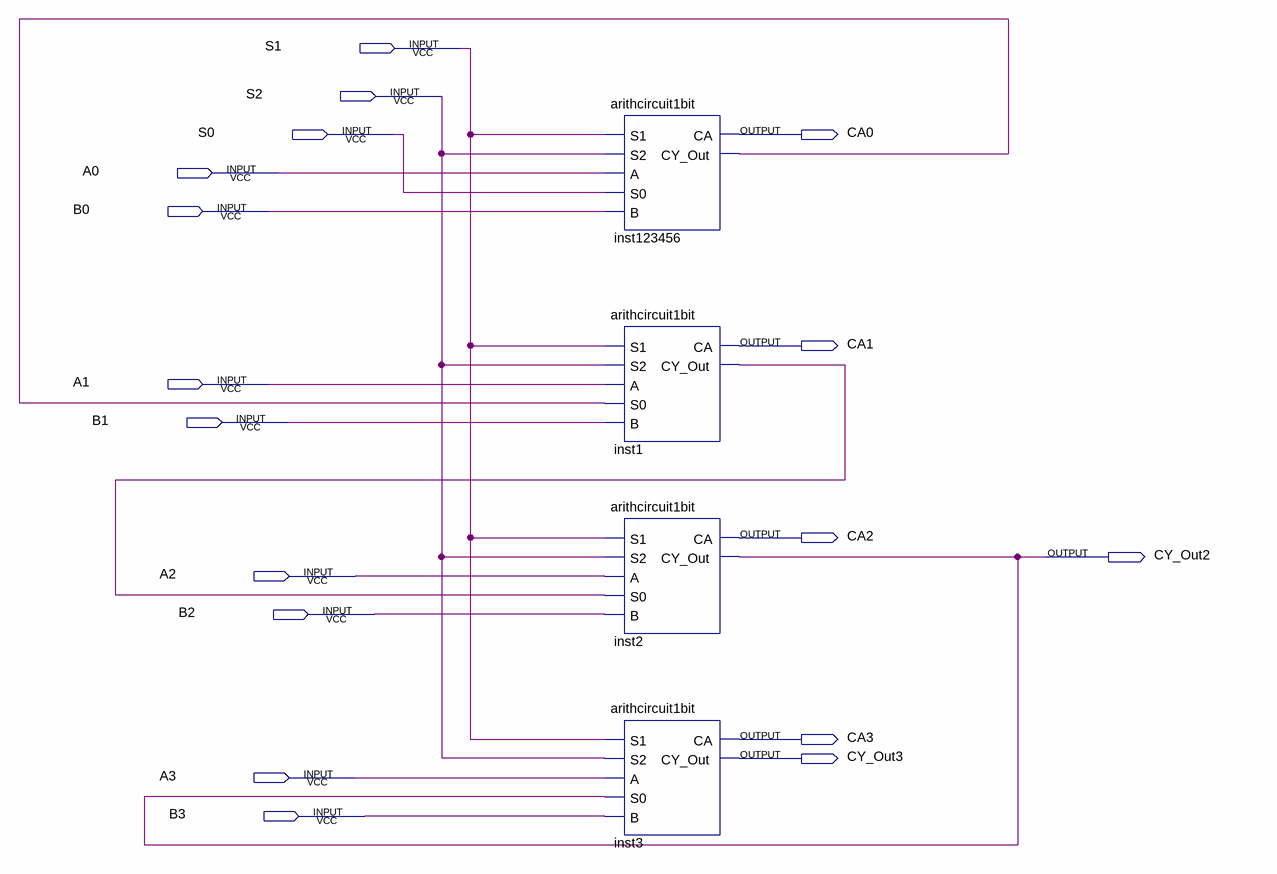
[diagram p0: schematic sheet]
// Quartus schematic arithcircuit4bits.bdf as structural Verilog: 4 symbols, 17 pins
module arithcircuit4bits (
  input  S1,
  input  S2,
  input  S0,
  input  A0,
  input  B0,
  input  A1,
  input  B1,
  input  A2,
  input  B2,
  input  A3,
  input  B3,
  output CA0,
  output CA1,
  output CA2,
  output CY_Out2,
  output CA3,
  output CY_Out3
);

  wire inst1_cy_out, inst123456_cy_out;

  arithcircuit1bit inst123456 (.S1(S1), .S2(S2), .A(A0), .S0(S0), .B(B0), .CA(CA0), .CY_Out(inst123456_cy_out));
  arithcircuit1bit inst1 (.S1(S1), .S2(S2), .A(A1), .S0(inst123456_cy_out), .B(B1), .CA(CA1), .CY_Out(inst1_cy_out));
  arithcircuit1bit inst2 (.S1(S1), .S2(S2), .A(A2), .S0(inst1_cy_out), .B(B2), .CA(CA2), .CY_Out(CY_Out2));
  arithcircuit1bit inst3 (.S1(S1), .S2(S2), .A(A3), .S0(CY_Out2), .B(B3), .CA(CA3), .CY_Out(CY_Out3));
endmodule
